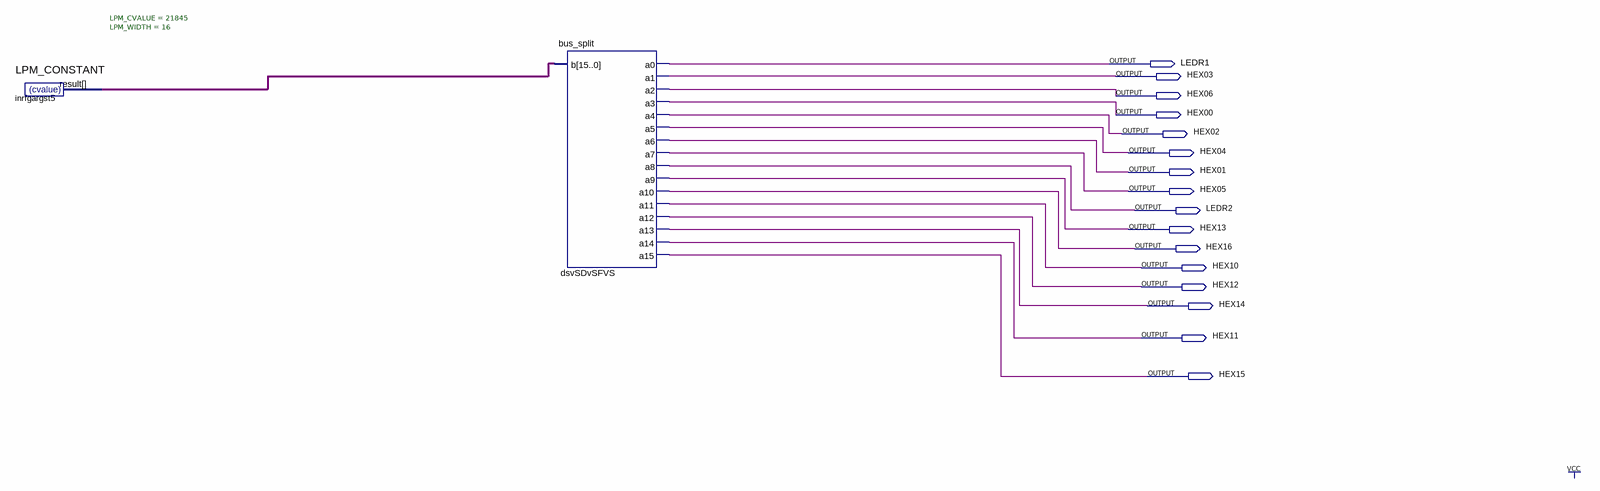
[diagram p0: schematic sheet]
// Quartus schematic random_testing.bdf as structural Verilog: 2 symbols, 16 pins
module random_testing (
  output LEDR1,
  output HEX03,
  output HEX06,
  output HEX00,
  output HEX02,
  output HEX04,
  output HEX01,
  output HEX05,
  output LEDR2,
  output HEX13,
  output HEX16,
  output HEX10,
  output HEX12,
  output HEX14,
  output HEX11,
  output HEX15
);

  wire [15:0] inrfgargst5_result;

  LPM_CONSTANT #(.LPM_CVALUE(21845), .LPM_WIDTH(16)) inrfgargst5 (.result(inrfgargst5_result));
  bus_split dsvSDvSFVS (
    .b(inrfgargst5_result), .a0(LEDR1), .a1(HEX03), .a2(HEX06), .a3(HEX00), .a4(HEX02), .a5(HEX04),
    .a6(HEX01), .a7(HEX05), .a8(LEDR2), .a9(HEX13), .a10(HEX16), .a11(HEX10), .a12(HEX12), .a13(HEX14),
    .a14(HEX11), .a15(HEX15));
endmodule
